# EAGLE design gCPW1 (EAGLE 7.4.0)
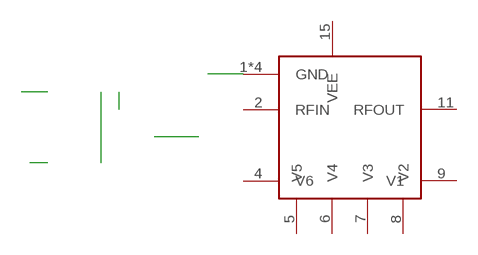
[diagram p0: schematic, sheet 1]

## Parts
U$1  HMC424  [HMC424]

## Nets
GND: U$1.1(GND) U$1.3(GND) U$1.10(GND) U$1.12(GND)
Unconnected: U$1.2(RFIN) U$1.4(V6) U$1.5(V5) U$1.6(V4) U$1.7(V3) U$1.8(V2) U$1.9(V1) U$1.11(RFOUT) U$1.15(VEE)

## Library data of the parts
U$1 = spietz-library:HMC424

## Net classes
0 default: width 0.203 mm
1 vcc: width 0.254 mm

## Board
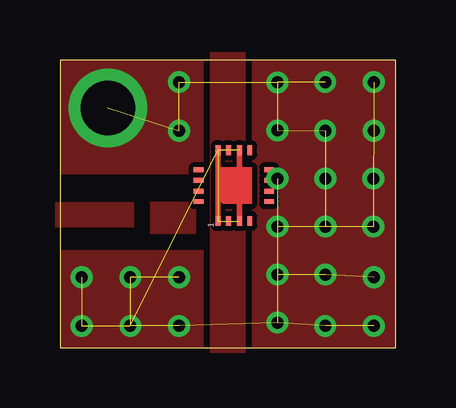
[diagram p1: board, top side]
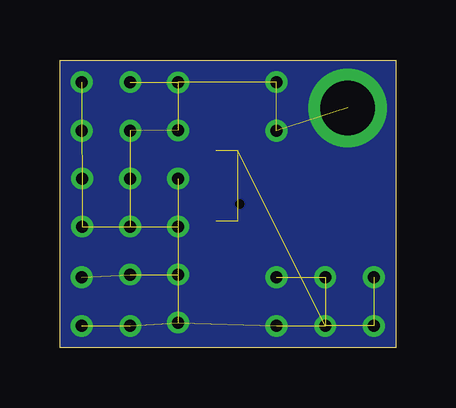
[diagram p2: board, bottom side, seen from below]

Size 14 x 12 mm. Coordinates in mm from the lower left corner, seen from the top.
Outline: 0,0 14,0 14,12 0,12 0,0
Copper layers (1*16): Top 0.035mm / dielectric 1.5mm / Bottom 0.035mm
Design rules "default *": minimum track width 10mil, minimum drill 24mil, track to track 8mil, track to pad 8mil, pad to pad 8mil, via to via 8mil, smd to smd 8mil, copper to edge 1mil, drill to drill 8mil, minimum pad ring 10mil, minimum via ring 8mil, stop-mask expansion 4mil, vias tented up to drill 0mil, thermal gap 10mil

### Footprints (pad centres in the part's own frame; a part is rotated, then mirrored left to right if it is on the bottom)
HMC424 = smd 0.406 x 0.203: 1 -0.711,1.422; 2 -0.711,0.991; 3 -0.711,0.533; 4 -0.711,0.102; 9 2.235,0.102; 10 2.235,0.533; 11 2.235,0.991; 12 2.235,1.422 | smd 0.203 x 0.406: 5 0.102,-0.711; 6 0.533,-0.711; 7 0.991,-0.711; 8 1.422,-0.711; 13 1.422,2.235; 14 0.991,2.235; 15 0.533,2.235; 16 0.102,2.235

### Placement (x,y rotation side)
U$1  8.02,6 90 top

### Tracks (layer width: path | path; a pad name or v marks a point on that pad's centre or on a via)
GND  (via drill 0.5, 2.26 pad 2.29)  (30 unrouted)
  other vias: 9.07,1.06 9.07,11.06 9.07,9.06 9.07,7.06 9.07,5.06 9.07,3.06 2,10 11.07,3.06 11.07,5.06 11.07,7.06 13.08,7.06 13.08,5.06 4.97,9.05 4.97,11.08 11.06,11.08 13.1,9.05 11.06,9.05 11.06,0.92 13.1,0.92 13.1,2.95 13.1,11.08 2.94,2.95 2.94,0.92 0.9,0.92 0.9,2.95 4.97,2.95 4.97,0.92
  pour Top: 14.08,12.32 8,12.32 8,-0.2 14.08,-0.2
  pour Bottom: -0.95,-0.71 15.02,-0.71 15.02,12.83 -0.95,12.83
  pour Top (rank 4): -0.44,4.07 6,4.07 6,-0.2 -0.44,-0.2
  pour Top: -0.26,12.32 6,12.32 6,7.24 -0.26,7.24
ISLAND
  pour Top: -0.19,5.06 3.08,5.06 3.08,6.06 -0.19,6.06
MAIN
  pour Top: 6.25,12.32 7.75,12.32 7.75,-0.2 6.25,-0.2
N$1
  pour Top: 3.77,4.75 3.77,6.09 5.65,6.09 5.65,4.75